# EAGLE design joystick_controller (EAGLE 6.5.0)
AUTHOR: Paul Qureshi; REV: 1.0
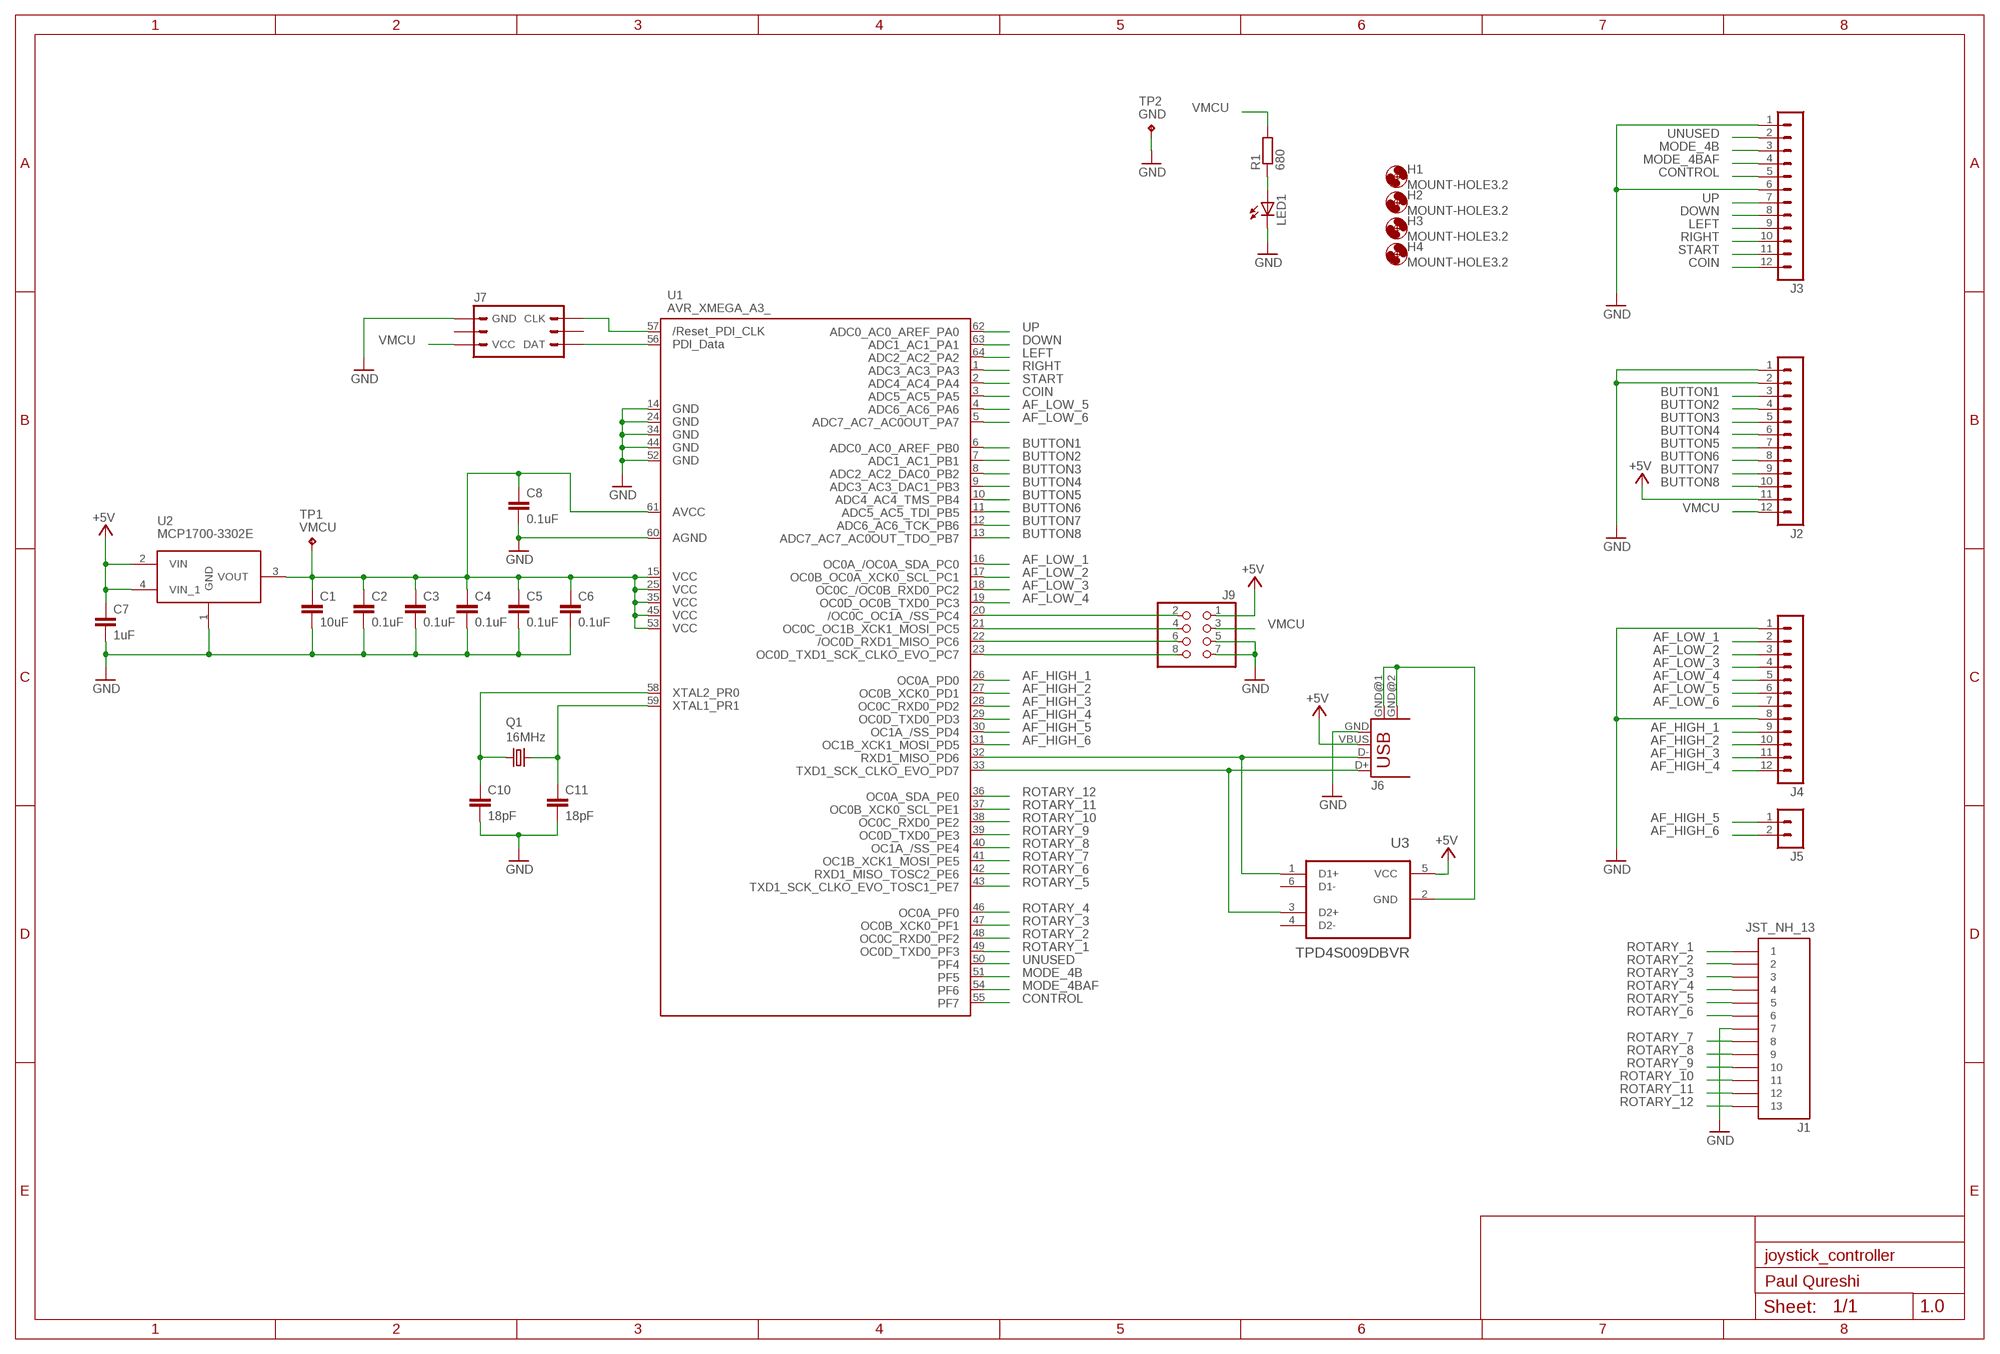
[diagram p0: schematic, sheet 1]

## Parts
C1  10uF  C-EUC0805  [C0805]
C2  0.1uF  C-EUC0805  [C0805]
C3  0.1uF  C-EUC0805  [C0805]
C4  0.1uF  C-EUC0805  [C0805]
C5  0.1uF  C-EUC0805  [C0805]
C6  0.1uF  C-EUC0805  [C0805]
C7  1uF  C-EUC0805  [C0805]
C8  0.1uF  C-EUC0805  [C0805]
C10  18pF  C-EUC0805  [C0805]
C11  18pF  C-EUC0805  [C0805]
H1  MOUNT-HOLE3.2  [3,2]
H2  MOUNT-HOLE3.2  [3,2]
H3  MOUNT-HOLE3.2  [3,2]
H4  MOUNT-HOLE3.2  [3,2]
J1  JST_NH_13  [JST_NH_13_RA]
J2  CON-3.5TERM-12  [CON-3.5TERM-12]
J3  CON-3.5TERM-12  [CON-3.5TERM-12]
J4  CON-3.5TERM-12  [CON-3.5TERM-12]
J5  CON-3.5TERM-2  [CON-3.5TERM-2]
J6  USB-B-H  [USB-B-H]
J7  PDI_HEADER  [MA03-2]
J9  PINHD-2X4  [2X04]
LED1  LEDCHIP-LED0805  [CHIP-LED0805]
Q1  16MHz  CRYSTALHC49S  [HC49/S]
R1  680  R-EU_R0805  [R0805]
TP1  VMCU  TEST_POINTS1751  [HARWIN-S1751-46]
TP2  GND  TEST_POINTS1751  [HARWIN-S1751-46]
U1  AVR_XMEGA_A3_  [TQFP64]
U2  MCP1700-3302E  MCP17-MCP1700T-3302E/MB  [SOT150P400X160-4N]
U3  TPD4S009DBVR  [SOT95P280X145-6N]

## Nets
+5V: C7.1 J2.11 J6.VBUS J9.1 U2.2(VIN) U2.4(VIN_1) U3.5(VCC)
AF_HIGH_1: J4.9 U1.26(PD0)
AF_HIGH_2: J4.10 U1.27(PD1)
AF_HIGH_3: J4.11 U1.28(PD2)
AF_HIGH_4: J4.12 U1.29(PD3)
AF_HIGH_5: J5.1 U1.30(PD4)
AF_HIGH_6: J5.2 U1.31(PD5)
AF_LOW_1: J4.2 U1.16(PC0)
AF_LOW_2: J4.3 U1.17(PC1)
AF_LOW_3: J4.4 U1.18(PC2)
AF_LOW_4: J4.5 U1.19(PC3)
AF_LOW_5: J4.6 U1.4(PA6)
AF_LOW_6: J4.7 U1.5(PA7)
BUTTON1: J2.3 U1.6(PB0)
BUTTON2: J2.4 U1.7(PB1)
BUTTON3: J2.5 U1.8(PB2)
BUTTON4: J2.6 U1.9(PB3)
BUTTON5: J2.7 U1.10(PB4)
BUTTON6: J2.8 U1.11(PB5)
BUTTON7: J2.9 U1.12(PB6)
BUTTON8: J2.10 U1.13(PB7)
COIN: J3.12 U1.3(PA5)
CONTROL: J3.5 U1.55(PF7)
D_M: J6.D- U1.32(PD6) U3.1(D1+)
D_P: J6.D+ U1.33(PD7) U3.3(D2+)
DOWN: J3.8 U1.63(PA1)
GND: C1.2 C2.2 C3.2 C4.2 C5.2 C6.2 C7.2 C8.2 C10.2 C11.2 J1.7 J2.1 J2.2 J3.1 J3.6 J4.1 J4.8 J6.GND J7.6(GND) J9.5 J9.7 LED1.C TP2.P$1(Q1) U1.14(GND1) U1.24(GND2) U1.34(GND3) U1.44(GND4) U1.52(GND5) U1.60(AGND) U2.1(GND)
LEFT: J3.9 U1.64(PA2)
MODE_4B: J3.3 U1.51(PF5)
MODE_4BAF: J3.4 U1.54(PF6)
N$1: LED1.A R1.1
N$3: J7.1(DAT) U1.56(PDI_DATA)
N$4: J7.5(CLK) U1.57(RESET)
N$5: J6.GND@1(GND) J6.GND@2(GND) U3.2(GND)
N$6: J9.8 U1.23(PC7)
N$7: J9.6 U1.22(PC6)
N$8: J9.4 U1.21(PC5)
N$9: J9.2 U1.20(PC4)
N$89: C11.1 Q1.2 U1.59(PR1)
N$90: C10.1 Q1.1 U1.58(PR0)
RIGHT: J3.10 U1.1(PA3)
ROTARY_1: J1.1 U1.49(PF3)
ROTARY_2: J1.2 U1.48(PF2)
ROTARY_3: J1.3 U1.47(PF1)
ROTARY_4: J1.4 U1.46(PF0)
ROTARY_5: J1.5 U1.43(PE7)
ROTARY_6: J1.6 U1.42(PE6)
ROTARY_7: J1.8 U1.41(PE5)
ROTARY_8: J1.9 U1.40(PE4)
ROTARY_9: J1.10 U1.39(PE3)
ROTARY_10: J1.11 U1.38(PE2)
ROTARY_11: J1.12 U1.37(PE1)
ROTARY_12: J1.13 U1.36(PE0)
START: J3.11 U1.2(PA4)
UNUSED: J3.2 U1.50(PF4)
UP: J3.7 U1.62(PA0)
VMCU: C1.1 C2.1 C3.1 C4.1 C5.1 C6.1 C8.1 J2.12 J7.2(VCC) J9.3 R1.2 TP1.P$1(Q1) U1.15(VCC1) U1.25(VCC2) U1.35(VCC3) U1.45(VCC4) U1.53(VCC5) U1.61(AVCC) U2.3(VOUT)
Unconnected: J7.3(NC) J7.4(NC) U3.4(D2-) U3.6(D1-)

## Notes on the sheet
- J6

## Library data of the parts
C1-C8 C10 C11 = rcl:C-EU: CAPACITOR, European symbol
H1-H4 = holes:MOUNT-HOLE: MOUNTING HOLE with drill center marker
J1 = paul_qureshi:JST_NH_13: JST NH series 13 pin connector
J2-J4 = paul_qureshi:CON-3.5TERM-12: 3.5mm pitch terminal block, 12 way
J5 = paul_qureshi:CON-3.5TERM-2: 3.5mm pitch terminal block, 2 way
J6 = con-usb-2:USB: USB Connectors
J7 = paul_qureshi:PDI_HEADER: Atmel PDI programming header
J9 = pinhead:PINHD-2X4: PIN HEADER
LED1 = led:LED: LED OSRAM: - CHIPLED LG R971, LG N971, LY N971, LG Q971, LY Q971, LO R971, LY R971 LH N974, LH R974 LS Q976, LO Q976, LY Q976 LO Q996 - Hyper CHIPLED LW Q18S LB Q993, LB Q99A, LB R99A - SideLED LS A670, LO A670, LY A670, LG A670, LP A670 LB A673, LV A673, LT A673, LW A673 LH A674 LY A675 LS A676, LA A676, LO A676, LY A676, LW A676 LS A679, LY A679, LG A679 - Hyper Micro SIDELED® LS Y876, LA Y876, LO Y876, LY Y876 LT Y87S - SmartLED LW L88C, LW L88S LB L89C, LB L89S, LG L890 LS L89K, LO L89K, LY L89K LS L896, LA L896, LO L896, LY L896 - TOPLED LS T670, LO T670, LY T670, LG T670, LP T670 LSG T670, LSP T670, LSY T670, LOP T670, LYG T670 LG T671, LOG T671, LSG T671 LB T673, LV T673, LT T673, LW T673 LH T674 LS T676, LA T676, LO T676, LY T676, LB T676, LH T676, LSB T676, LW T676 LB T67C, LV T67C, LT T67C, LS T67K, LO T67K, LY T67K, LW E67C LS E67B, LA E67B, LO E67B, LY E67B, LB E67C, LV E67C, LT E67C LW T67C LS T679, LY T679, LG T679 LS T770, LO T770, LY T770, LG T770, LP T770 LB T773, LV T773, LT T773, LW T773 LH T774 LS E675, LA E675, LY E675, LS T675 LS T776, LA T776, LO T776, LY T776, LB T776 LHGB T686 LT T68C, LB T68C - Hyper Mini TOPLED® LB M676 - Mini TOPLED Santana® LG M470 LS M47K, LO M47K, LY M47K Source: http://www.osram.convergy.de LUXEON: - LUMILED® LXK2-PW12-R00, LXK2-PW12-S00, LXK2-PW14-U00, LXK2-PW14-V00 LXK2-PM12-R00, LXK2-PM12-S00, LXK2-PM14-U00 LXK2-PE12-Q00, LXK2-PE12-R00, LXK2-PE12-S00, LXK2-PE14-T00, LXK2-PE14-U00 LXK2-PB12-K00, LXK2-PB12-L00, LXK2-PB12-M00, LXK2-PB14-N00, LXK2-PB14-P00, LXK2-PB14-Q00 LXK2-PR12-L00, LXK2-PR12-M00, LXK2-PR14-Q00, LXK2-PR14-R00 LXK2-PD12-Q00, LXK2-PD12-R00, LXK2-PD12-S00 LXK2-PH12-R00, LXK2-PH12-S00 LXK2-PL12-P00, LXK2-PL12-Q00, LXK2-PL12-R00 Source: www.luxeon.com KINGBRIGHT: KA-3528ASYC Source: www.kingbright.com
Q1 = crystal:CRYSTAL: CRYSTAL; OC_FARNELL: 1667008; OC_NEWARK: unknown
R1 = resistor:R-EU_: RESISTOR, European symbol
TP1 TP2 = paul_qureshi:TEST_POINT: Test point
U1 = xmega:AVR_XMEGA_A3_: Device for Atmel AVR XMEGA A3 Series
U2 = paul_qureshi:MCP17: Low Quiescent Current LDO Regulator; MPN: MCP1700T-3302E/MB; OC_FARNELL: 1439380; OC_NEWARK: 88H9816; PACKAGE: SOT89-3; SUPPLIER: Microchip
U3 = paul_qureshi:TPD4S009DBVR: 4-CHANNEL ESD SOLUTION FOR HIGH-SPEED DIFFERENTIAL INTERFACE; MPN: TPD4S009DBVR; OC_FARNELL: 1855143; OC_NEWARK: 33R2191; PACKAGE: SOT-23-6; SUPPLIER: TEXAS INSTRUMENTS

## Board
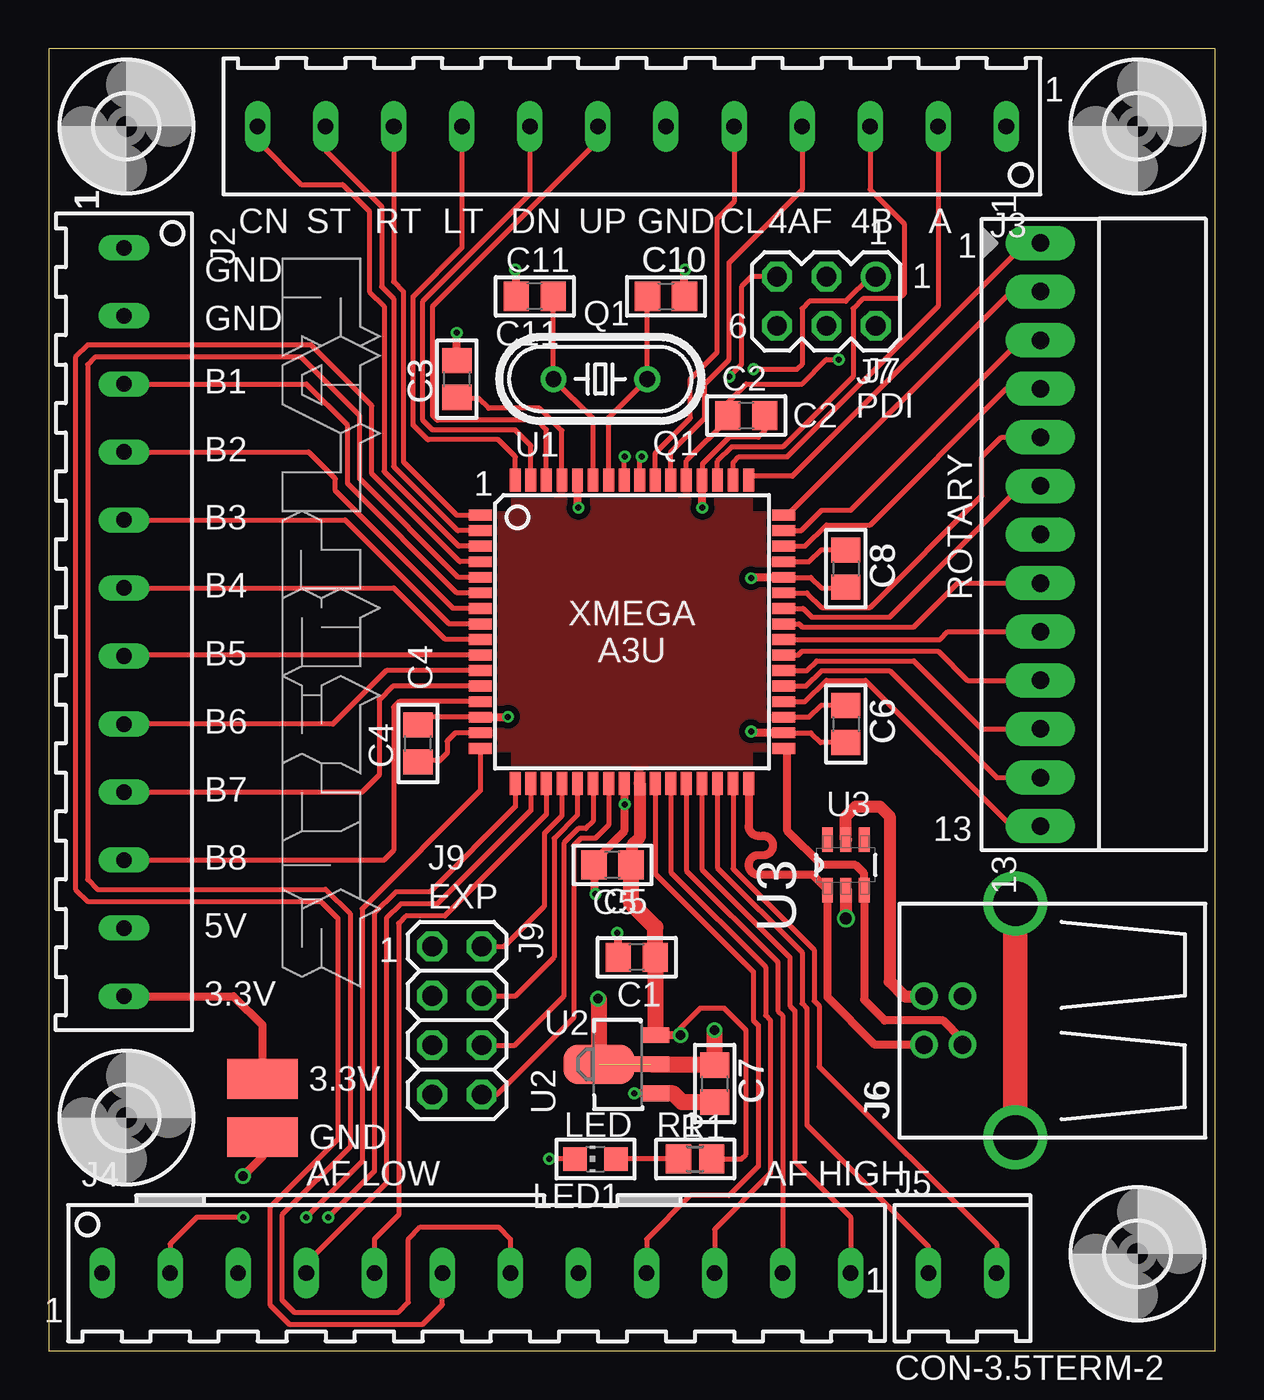
[diagram p1: board, top side]
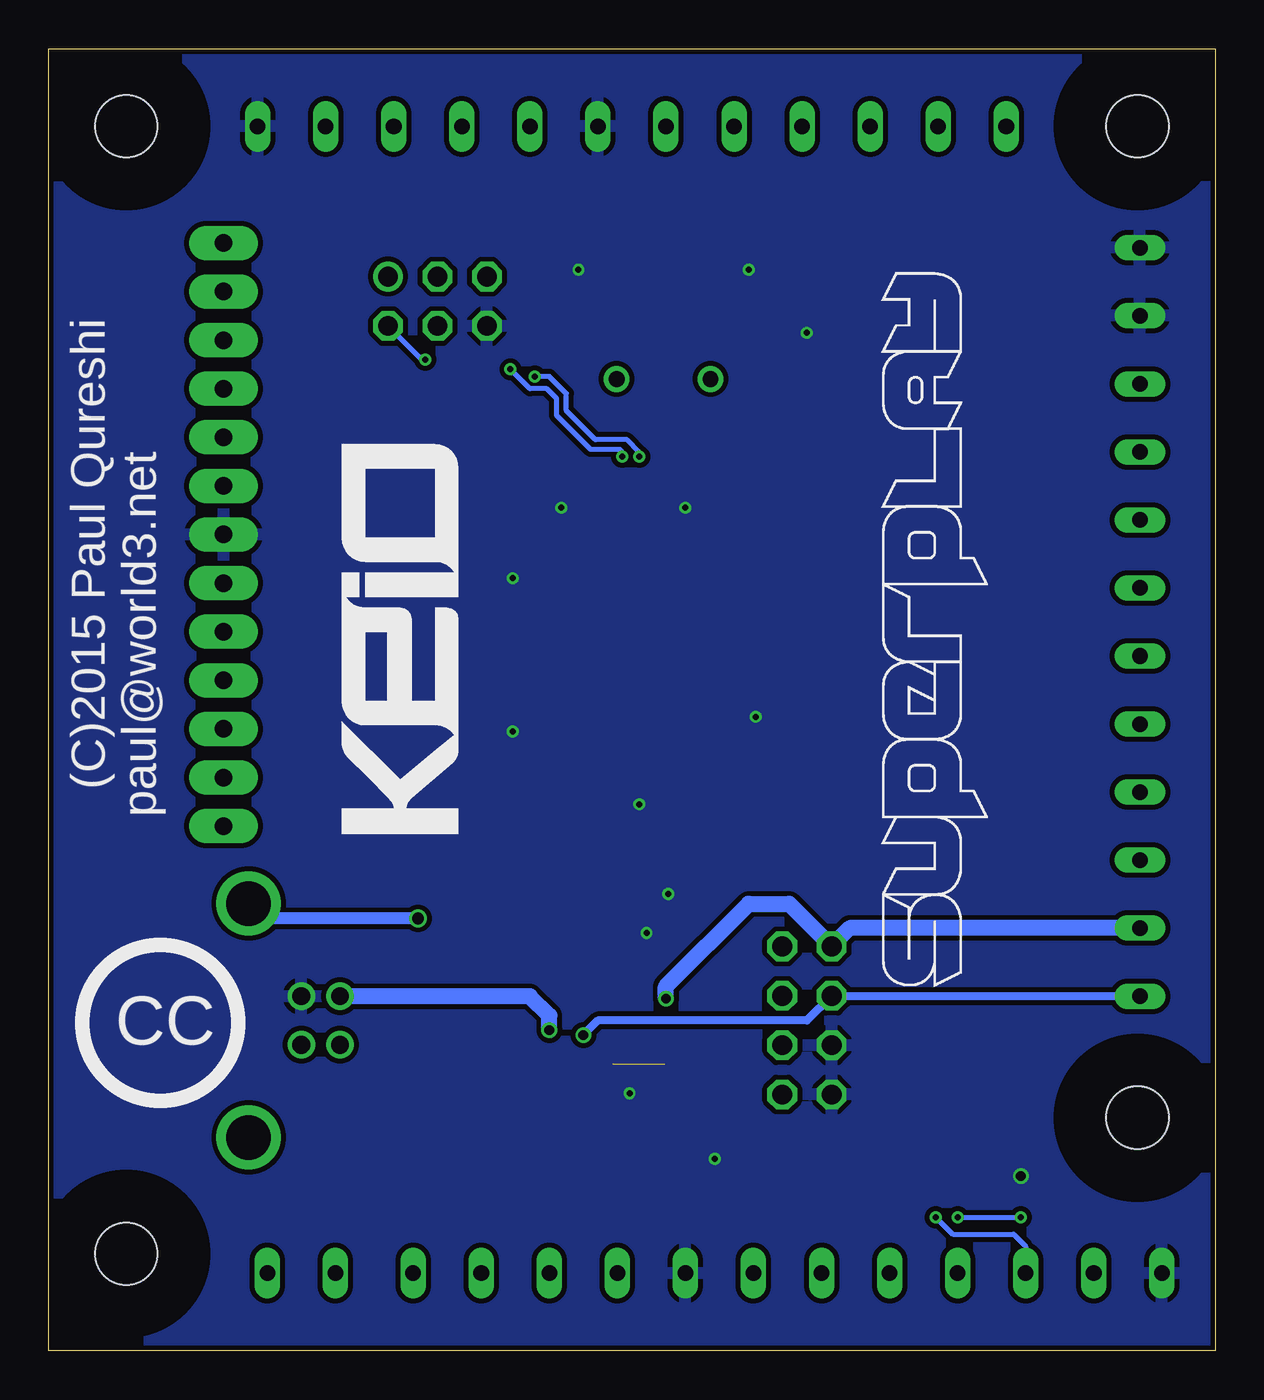
[diagram p2: board, bottom side, seen from below]

Size 60 x 67 mm. Coordinates in mm from the lower left corner, seen from the top.
Outline: 0,0 60,0 60,67 0,67 0,0
Copper layers (1*16): Top 0.035mm / dielectric 1.5mm / Bottom 0.035mm
Design rules "SeeedStudio_2layer_DRU_no_angle_20140221": minimum track width 6mil, minimum drill 12mil, track to track 6mil, track to pad 6mil, pad to pad 6mil, via to via 6mil, smd to smd 0mil, copper to edge 10mil, drill to drill 10mil, minimum pad ring 10mil, minimum via ring 6mil, stop-mask expansion 2mil, vias tented up to drill 100mil, thermal gap 10mil

### Footprints (pad centres in the part's own frame; a part is rotated, then mirrored left to right if it is on the bottom)
C0805 = smd 1.3 x 1.5: 1 -0.95,0; 2 0.95,0
3,2 = hole 3.2: 0,0
JST_NH_13_RA = drill 0.9 pad 1.778 long: 1 -15,0; 2 -12.5,0; 3 -10,0; 4 -7.5,0; 5 -5,0; 6 -2.5,0; 7 0,0; 8 2.5,0; 9 5,0; 10 7.5,0; 11 10,0; 12 12.5,0; 13 15,0
CON-3.5TERM-12 = drill 0.8 long: 1 -19.25,0; 2 -15.75,0; 3 -12.25,0; 4 -8.75,0; 5 -5.25,0; 6 -1.75,0; 7 1.75,0; 8 5.25,0; 9 8.75,0; 10 12.25,0; 11 15.75,0; 12 19.25,0
CON-3.5TERM-2 = drill 0.8 long: 1 -1.75,0; 2 1.75,0
USB-B-H = drill 0.914: D+ 0,1.25; D- 1.981,1.25; GND 0,-1.25; VBUS 1.981,-1.25 | drill 2.286: GND@1 -2.718,6.02; GND@2 -2.718,-6.02
MA03-2 = drill 1.016: 1 -2.54,-1.27 | drill 1.016 octagon: 2 -2.54,1.27; 3 0,-1.27; 4 0,1.27; 5 2.54,-1.27; 6 2.54,1.27
2X04 = drill 1.016 octagon: 1 -3.81,-1.27; 2 -3.81,1.27; 3 -1.27,-1.27; 4 -1.27,1.27; 5 1.27,-1.27; 6 1.27,1.27; 7 3.81,-1.27; 8 3.81,1.27
CHIP-LED0805 = smd 1.2 x 1.2: A 0,-1.05; C 0,1.05
HC49/S = drill 0.813: 1 -2.413,0; 2 2.413,0
R0805 = smd 1.3 x 1.5: 1 -0.85,0; 2 0.85,0
HARWIN-S1751-46 = smd 3.65 x 2.05: P$1 0,0
TQFP64 = smd 1.194 x 0.559: 1 -7.8,6; 2 -7.8,5.2; 3 -7.8,4.4; 4 -7.8,3.6; 5 -7.8,2.8; 6 -7.8,2; 7 -7.8,1.2; 8 -7.8,0.4; 9 -7.8,-0.4; 10 -7.8,-1.2; 11 -7.8,-2; 12 -7.8,-2.8; 13 -7.8,-3.6; 14 -7.8,-4.4; 15 -7.8,-5.2; 16 -7.8,-6; 33 7.8,-6; 34 7.8,-5.2; 35 7.8,-4.4; 36 7.8,-3.6; 37 7.8,-2.8; 38 7.8,-2; 39 7.8,-1.2; 40 7.8,-0.4; 41 7.8,0.4; 42 7.8,1.2; 43 7.8,2; 44 7.8,2.8; 45 7.8,3.6; 46 7.8,4.4; 47 7.8,5.2; 48 7.8,6 | smd 0.559 x 1.194: 17 -6,-7.8; 18 -5.2,-7.8; 19 -4.4,-7.8; 20 -3.6,-7.8; 21 -2.8,-7.8; 22 -2,-7.8; 23 -1.2,-7.8; 24 -0.4,-7.8; 25 0.4,-7.8; 26 1.2,-7.8; 27 2,-7.8; 28 2.8,-7.8; 29 3.6,-7.8; 30 4.4,-7.8; 31 5.2,-7.8; 32 6,-7.8; 49 6,7.8; 50 5.2,7.8; 51 4.4,7.8; 52 3.6,7.8; 53 2.8,7.8; 54 2,7.8; 55 1.2,7.8; 56 0.4,7.8; 57 -0.4,7.8; 58 -1.2,7.8; 59 -2,7.8; 60 -2.8,7.8; 61 -3.6,7.8; 62 -4.4,7.8; 63 -5.2,7.8; 64 -6,7.8
SOT150P400X160-4N = smd 0.8 x 1.4: 1 -1.499,-1.981; 3 1.499,-1.981 | smd 0.8 x 1.9: 2 0,-1.727 | smd 2.032 x 3.65: 4 0,0.94
SOT95P280X145-6N = smd 1.27 x 0.559: 1 -1.295,0.94; 2 -1.295,0; 3 -1.295,-0.94; 4 1.295,-0.94; 5 1.295,0; 6 1.295,0.94

### Placement (x,y rotation side)
C1  30.25,20.25 180 top
C2  35.88,48.12 0 top
C3  21,50 90 top
C4  19,31.25 90 top
C5  29,25 180 top
C6  41,32.25 270 top
C7  34.25,13.75 270 top
C8  41,40.25 270 top
C10  31.75,54.25 0 top
C11  25,54.25 180 top
H1  4,12 0 top
H2  56,63 0 top
H3  56,5 0 top
H4  4,63 0 top
J1  51,42 270 top
J2  3.88,37.5 270 top
J3  30,63 180 top
J4  22,4 0 top
J5  47,4 0 top
J6  47,17 180 top
J7  40,54 180 top
J9  21,17 270 top
LED1  28.12,9.88 90 top
Q1  28.38,50 180 top
R1  33.25,9.88 0 top
TP1  11,14 0 top
TP2  11,11 0 top
U1  30,37 0 top
U2  29.25,14.75 90 top
U3  41,25 90 top

### Tracks (layer width: path | path; a pad name or v marks a point on that pad's centre or on a via)
+5V  (via drill 0.5)  (1 unrouted)
  Top 0.61: U3.5 41,27.5 41.5,28 42.75,28 43.25,27.5 43.25,19 44,18.25 J6.VBUS
  Top 0.813: U2.2 34.2,14.75 C7.1 v34.25,16.5 | U2.4 28.31,18.07 v28.25,18.12
  Bottom 0.813: v34.25,16.5 34.25,17.25 35.25,18.25 J6.VBUS | v28.25,18.12 28.25,18.75 24,23 21.92,23 J9.1 18.79,21.75 J2.11
AF_HIGH_1
  Top 0.254: U1.26 31.2,24.55 36.25,19.5 36.25,17 36.5,16.75 36.5,9.5 35,8 33,8 30.75,5.75 J4.9
AF_HIGH_2
  Top 0.254: U1.27 32,24.62 36.88,19.75 36.88,17.25 37.12,17 37.12,9.12 34.25,6.25 J4.10
AF_HIGH_3
  Top 0.254: U1.28 32.8,24.7 37.5,20 37.5,17.5 37.75,17.25 J4.11
AF_HIGH_4
  Top 0.254: U1.29 33.6,24.77 38.12,20.25 38.12,17.75 38.38,17.5 38.38,9.75 41.25,6.88 J4.12
AF_HIGH_5
  Top 0.254: U1.30 34.4,24.85 38.75,20.5 38.75,17.88 39,17.62 39,11.62 45.25,5.38 J5.1
AF_HIGH_6
  Top 0.254: U1.31 35.2,24.8 39.38,20.62 39.38,18 39.62,17.75 39.62,14.62 48.75,5.5 J5.2
AF_LOW_1  (via drill 0.31)
  Top 0.254: U1.16 22.2,28.82 16.12,22.75 16.12,9.75 v13.25,6.88 | v10,6.88 7.62,6.88 6.25,5.5 J4.2
  Bottom 0.254: v13.25,6.88 v10,6.88
AF_LOW_2  (via drill 0.31)
  Top 0.254: U1.17 24,28 19.62,23.62 17.88,23.62 16.75,22.5 16.75,9.25 v14.38,6.88
  Bottom 0.254: v14.38,6.88 13.5,6 10.38,6 9.75,5.38 J4.3
AF_LOW_3
  Top 0.254: U1.18 24.8,27.8 20,23 18.12,23 17.38,22.25 17.38,8.62 13.25,4.5 J4.4
AF_LOW_4
  Top 0.254: U1.19 25.6,27.6 20.38,22.38 18.38,22.38 18,22 18,7 16.75,5.75 J4.5
AF_LOW_5
  Top 0.254: U1.4 21.15,40.6 16.62,45.12 16.62,48.62 13.5,51.75 2,51.75 1.38,51.12 1.38,23.75 2,23.12 14,23.12 14.88,22.25 14.88,10.88 11.38,7.38 11.38,2.38 12.38,1.38 19.25,1.38 20.25,2.38 J4.6
AF_LOW_6
  Top 0.254: U1.5 21.07,39.8 16,44.88 16,48.12 13,51.12 2.38,51.12 2,50.75 2,24.25 2.5,23.75 14.25,23.75 15.5,22.5 15.5,10.5 12,7 12,2.62 12.62,2 18,2 18.5,2.5 18.5,5.75 19.12,6.38 23.12,6.38 23.75,5.75 J4.7
BUTTON1
  Top 0.254: U1.6 21,39 15.38,44.62 15.38,47.62 13.25,49.75 J2.3
BUTTON2
  Top 0.254: U1.7 20.8,38.2 14.75,44.25 14.75,44.88 13.38,46.25 J2.4
BUTTON3
  Top 0.254: U1.8 20.6,37.4 15.25,42.75 J2.5
BUTTON4
  Top 0.254: U1.9 20.4,36.6 17.75,39.25 J2.6
BUTTON5
  Top 0.254: U1.10 3.92,35.8 J2.7
BUTTON6
  Top 0.254: U1.11 17.38,35 14.62,32.25 J2.8
BUTTON7
  Top 0.254: U1.12 17.7,34.2 17,33.5 17,29.62 16.12,28.75 J2.9
BUTTON8
  Top 0.254: U1.13 18.02,33.4 17.75,33.12 17.75,25.75 17.25,25.25 J2.10
COIN
  Top 0.254: J3.12 10.75,62.25 13,60 15.12,60 16.5,58.62 16.5,54.5 17.25,53.75 17.25,45.25 21.1,41.4 U1.3
CONTROL
  Top 0.254: J3.5 35.25,59.12 34.38,58.25 34.38,51.38 33,50 33,48 31.2,46.2 U1.55
D_M
  Top 0.406: J6.D- 42.5,15.75 40.06,18.19 U3.1 39.27,24.5 36.5,24.5 arc-90 36,25 arc-90 36.5,25.5 36.75,25.5 arc90 37.25,26 arc90 36.75,26.5 36.5,26.5 arc-90 36,27 U1.32
D_P
  Top 0.406: J6.D+ 47,16 46,17 43,17 41.94,18.06 U3.3 41.94,24.56 41.5,25 39.75,25 38,26.75 38,30.8 U1.33
DOWN
  Top 0.254: U1.63 24.8,46.58 24,47.38 19.75,47.38 19.25,47.88 19.25,54 24.75,59.5 J3.8
GND  (via drill 0.31, 0.5)
  Top 0.254: U1.44 39.2,39.8 39.75,39.25 40.95,39.25 C8.2 | U1.34 39.2,31.8 39.7,31.3 C6.2 | U1.14 19.4,32.6 C4.2 | C2.2 36.83,47.33 36.5,47 35,47 33.62,45.62 33.62,44.83 U1.52 | LED1.C v25.75,9.88
  Top 0.406: U1.24 29.6,26.73 28.05,25.18 C5.2 28.05,23.57 v28.12,23.5 | C1.2 29.3,21.45 v29.25,21.5 | U2.1 v30.12,13.25 | U1.14 23.6,32.6 v23.62,32.62 | U1.44 36.17,39.8 v36.12,39.75 | U1.52 33.6,43.4 v33.62,43.38 | U1.60 27.2,43.42 v27.25,43.38 | U1.34 36.2,31.8 v36.12,31.88 | C3.2 v21,52.38 | C11.2 24.05,55.58 v24,55.62 | C10.2 32.7,55.58 v32.75,55.62 | TP2.P$1 11,10 v10,9
  Top 0.813: C7.2 32.58,12.8 32.12,13.25 U2.1
  other vias: 29.62,28.12
  pour Bottom (isolate 0.254): 0,67 60,67 60,0 0,0
LEFT
  Top 0.254: U1.64 24,46 23.12,46.88 19.5,46.88 18.75,47.62 18.75,54.25 21.25,56.75 J3.9
MODE_4B
  Top 0.254: J3.3 42.25,59.75 44,58 44,54.38 43.75,54.12 41.88,54.12 41.38,53.62 41.38,50.12 37.75,46.5 35.12,46.5 34.4,45.77 U1.51
MODE_4BAF
  Top 0.254: J3.4 38.75,59.75 35,56 35,51 33.75,49.75 33.75,48 32,46.25 U1.54
N$1
  Top 0.254: R1.1 LED1.A
N$3  (via drill 0.31)
  Top 0.254: U1.56 30.4,45.9 v30.5,46 | J7.1 42.27,55.27 41,54 39.12,54 38.75,53.62 38.75,50.75 38.5,50.5 v36.25,50.5
  Bottom 0.254: v30.5,46 30.5,46.25 30.62,46.38 32.12,46.38 33.88,48.12 33.88,49 34.38,49.5 35.25,49.5 v36.25,50.5
N$4  (via drill 0.31)
  Top 0.254: U1.57 29.6,45.98 v29.62,46 | J7.5 36.15,55.27 35.62,54.75 35.62,50.75 v35,50.12
  Bottom 0.254: v29.62,46 29.62,46.25 30.25,46.88 31.88,46.88 33.38,48.38 33.38,49.25 34.25,50.12 v35,50.12
N$5  (via drill 0.6)
  Top 0.61: U3.2 v41,22.25
  Top 1.27: J6.GND@1 J6.GND@2
  Bottom 0.61: v41,22.25 48.95,22.25 J6.GND@2
N$6
  Top 0.254: U1.23 28.8,27.05 28.12,26.38 27.38,26.38 27,26 27,17.12 23.07,13.19 J9.8
N$7
  Top 0.254: U1.22 28,27.25 27.62,26.88 27.25,26.88 26.5,26.12 26.5,18.25 23.98,15.73 J9.6
N$8
  Top 0.254: U1.21 27.2,27.57 26,26.38 26,20.25 24.02,18.27 J9.4
N$9
  Top 0.254: U1.20 26.4,27.52 25.5,26.62 25.5,22.88 23.43,20.81 J9.2
N$89
  Top 0.254: U1.59 28,47.96 Q1.2 25.96,54.24 C11.1
N$90
  Top 0.254: U1.58 28.8,48.01 Q1.1 30.79,54.24 C10.1
RIGHT
  Top 0.254: J3.10 17.75,55 18.25,54.5 18.25,45.75 21,43 U1.1
ROTARY_1
  Top 0.254: J1.1 50.25,57 38.25,45 36.2,45 U1.49
ROTARY_2
  Top 0.254: 38,43 49.5,54.5 J1.2
  Top 0.406: U1.48 38,43
ROTARY_3
  Top 0.254: U1.47 38.7,42.2 39.75,43.25 41.25,43.25 50,52 J1.3
ROTARY_4
  Top 0.254: U1.46 38.9,41.4 40,42.5 42.25,42.5 49.25,49.5 J1.4
ROTARY_5
  Top 0.254: U1.43 39,39 39.75,38.25 42.25,38.25 48,44 48,46 49,47 J1.5
ROTARY_6
  Top 0.254: U1.42 38.8,38.2 39.25,37.75 43.25,37.75 50,44.5 J1.6
ROTARY_7
  Top 0.254: U1.41 38.6,37.4 38.75,37.25 44.5,37.25 46.75,39.5 J1.8
ROTARY_8
  Top 0.254: U1.40 45.85,36.6 46.25,37 J1.9
ROTARY_9
  Top 0.254: U1.39 38.55,35.8 38.75,36 45.75,36 47.25,34.5 J1.10
ROTARY_10
  Top 0.254: U1.38 39,35 39.5,35.5 44.5,35.5 48,32 J1.11
ROTARY_11
  Top 0.254: U1.37 38.95,34.2 39.75,35 43.25,35 48.75,29.5 J1.12
ROTARY_12
  Top 0.254: U1.36 38.9,33.4 40,34.5 42,34.5 49.5,27 J1.13
START
  Top 0.254: J3.11 14.25,61.75 17.12,58.88 17.12,54.75 17.75,54.12 17.75,45.5 21.05,42.2 U1.2
UNUSED
  Top 0.254: J3.2 45.75,53.75 38,46 35.5,46 35.2,45.7 U1.50
UP
  Top 0.254: U1.62 25.6,47.4 25.12,47.88 20,47.88 19.75,48.12 19.75,53.75 28,62 28,62.75 J3.7
VMCU  (via drill 0.31, 0.5)
  Top 0.254: U1.45 39.1,40.6 39.7,41.2 C8.1 | U1.35 39.1,32.6 39.7,33.2 C6.1 | U1.61 26.4,47.35 25.25,48.5 22.62,48.5 22.12,49 21.05,49 C3.1 | U1.15 20.93,31.8 20.5,31.38 20.5,30.75 20.12,30.38 19.07,30.38 C4.1 | U1.53 32.8,45.8 34.92,47.92 C2.1 34.92,48.8 35.88,49.75 38.75,49.75 40,51 v40.62,51 | R1.2 35.62,9.88 35.88,10.12 35.88,16.5 34.75,17.62 33.5,17.62 32.5,16.62 v32.5,16.25
  Top 0.406: U2.3 v32.5,16.25 | TP1.P$1 11,16.75 9.5,18.25 J2.12
  Top 0.61: U1.25 30.4,26.4 30,26 30,25.05 C5.1
  Top 0.813: U2.3 31.23,20.22 C1.1 31.2,21.8 29.95,23.05 C5.1
  Bottom 0.254: v40.62,51 40.81,51 J7.2
  Bottom 0.406: v32.5,16.25 31.75,17 21,17 J9.3 4.52,18.27 J2.12
  pour Top (isolate 0.305): 24,45 36,45 36,43 38,43 38,31 36,31 36,29 24,29 24,31 22,31 22,43 24,43

### Text on the board
_tplace: 1 | CN | ST | RT | LT | DN | UP | GND | CL | 4AF | 4B | A | 1 | C11 | C10 | 1 | GND | Q1 | GND | J7 | B1 | C3 | C2 | PDI | B2 | 1 | B3 | B4 | C8 | ROTARY | XMEGA / A3U | B5 | C4 | B6 | C6 | B7 | U3 | 13 | B8 | J9 | EXP | C5 | 5V | 1 | 3.3V | U2 | 3.3V | C7 | J6 | LED | R1 | GND | AF LOW | AF HIGH | 1
_bplace: (C)2015 Paul Qureshi | paul@world3.net | CC